# Altium project AMC_FMC_Carrier v2.PrjPcb (part 5 of 9)

## Sheet FPGA_MGT.SchDoc
size A2; DocumentNumber: 17; SheetNumber: 17; SheetTotal: 30
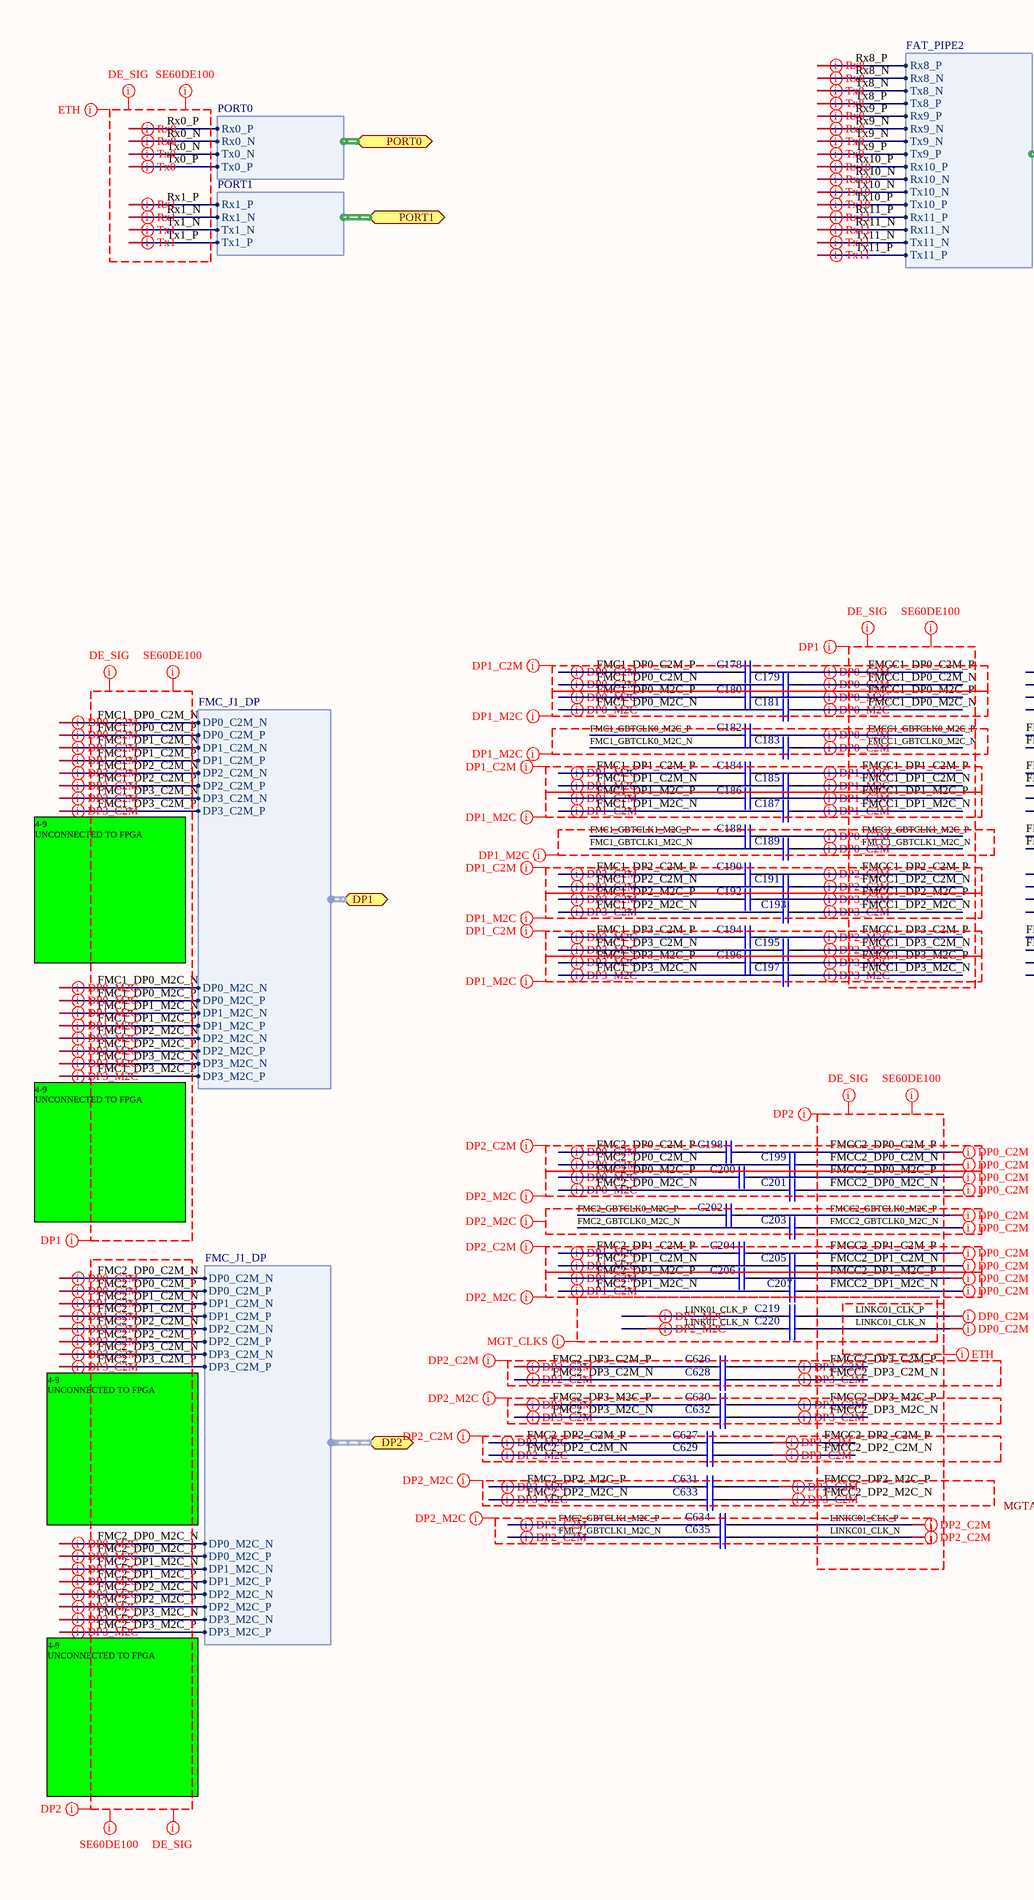
[diagram p7: FPGA_MGT.SchDoc, left]
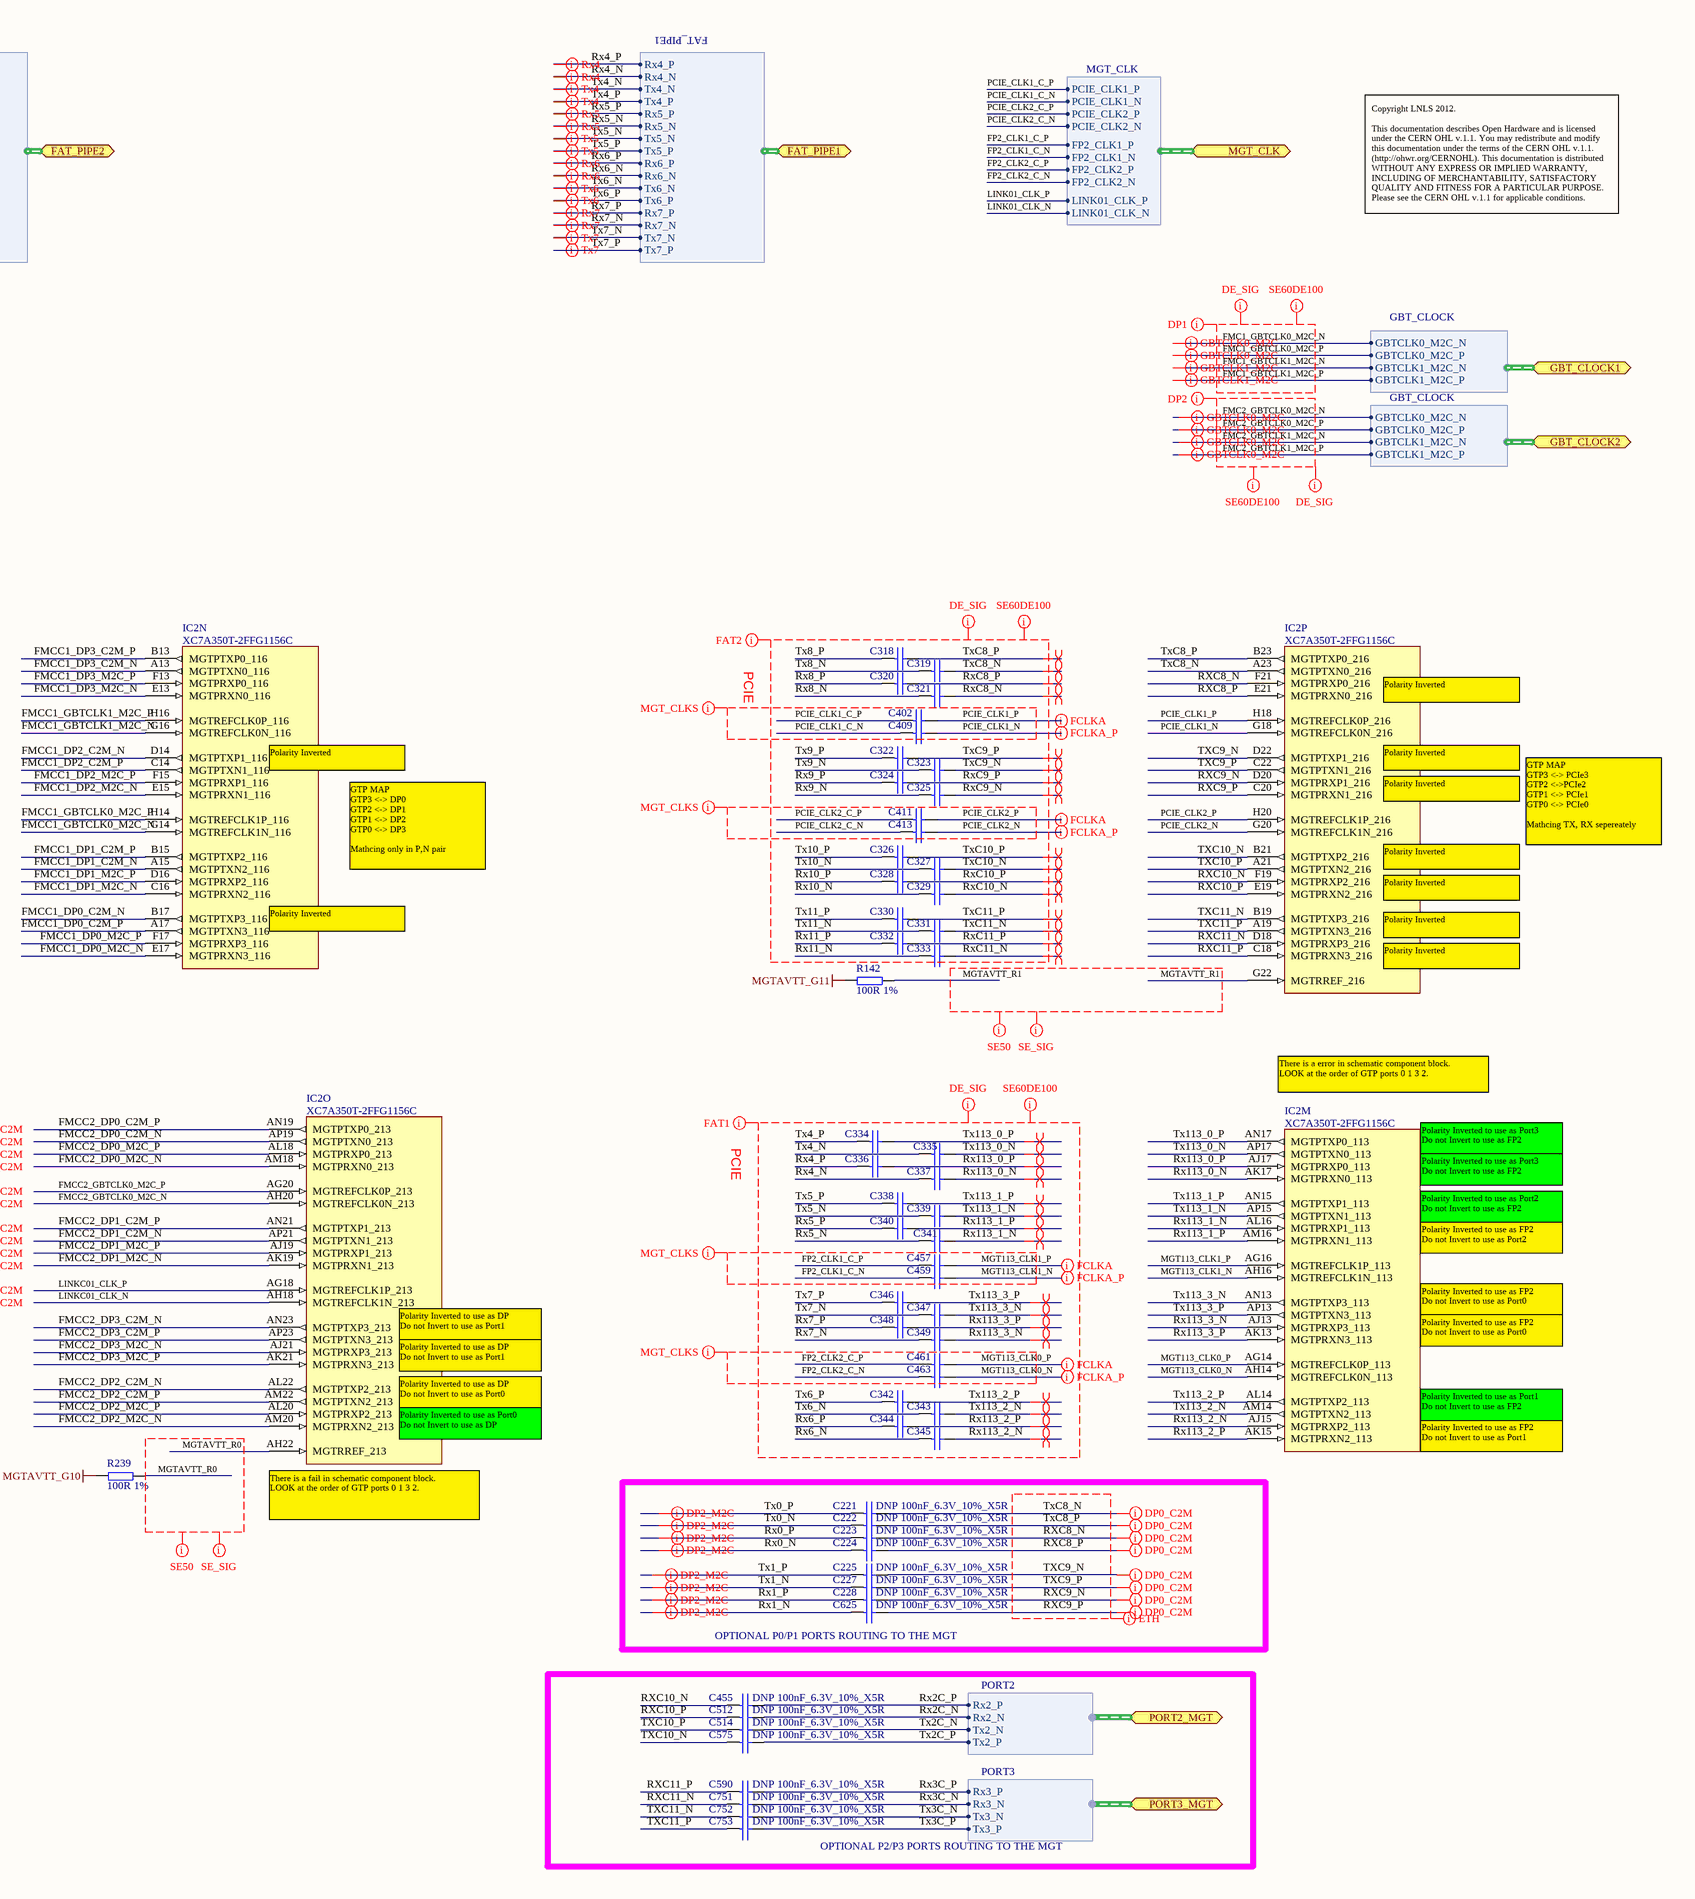
[diagram p8: FPGA_MGT.SchDoc, right]

### Parts
C178  100nF_6.3V_10%_X5R  [0201C]  (value not drawn)
C179  100nF_6.3V_10%_X5R  [0201C]  (value not drawn)
C180  100nF_6.3V_10%_X5R  [0201C]  (value not drawn)
C181  100nF_6.3V_10%_X5R  [0201C]  (value not drawn)
C182  100nF_6.3V_10%_X5R  [0201C]  (value not drawn)
C183  100nF_6.3V_10%_X5R  [0201C]  (value not drawn)
C184  100nF_6.3V_10%_X5R  [0201C]  (value not drawn)
C185  100nF_6.3V_10%_X5R  [0201C]  (value not drawn)
C186  100nF_6.3V_10%_X5R  [0201C]  (value not drawn)
C187  100nF_6.3V_10%_X5R  [0201C]  (value not drawn)
C188  100nF_6.3V_10%_X5R  [0201C]  (value not drawn)
C189  100nF_6.3V_10%_X5R  [0201C]  (value not drawn)
C190  100nF_6.3V_10%_X5R  [0201C]  (value not drawn)
C191  100nF_6.3V_10%_X5R  [0201C]  (value not drawn)
C192  100nF_6.3V_10%_X5R  [0201C]  (value not drawn)
C193  100nF_6.3V_10%_X5R  [0201C]  (value not drawn)
C194  100nF_6.3V_10%_X5R  [0201C]  (value not drawn)
C195  100nF_6.3V_10%_X5R  [0201C]  (value not drawn)
C196  100nF_6.3V_10%_X5R  [0201C]  (value not drawn)
C197  100nF_6.3V_10%_X5R  [0201C]  (value not drawn)
C198  100nF_6.3V_10%_X5R  [0201C]  (value not drawn)
C199  100nF_6.3V_10%_X5R  [0201C]  (value not drawn)
C200  100nF_6.3V_10%_X5R  [0201C]  (value not drawn)
C201  100nF_6.3V_10%_X5R  [0201C]  (value not drawn)
C202  100nF_6.3V_10%_X5R  [0201C]  (value not drawn)
C203  100nF_6.3V_10%_X5R  [0201C]  (value not drawn)
C204  100nF_6.3V_10%_X5R  [0201C]  (value not drawn)
C205  100nF_6.3V_10%_X5R  [0201C]  (value not drawn)
C206  100nF_6.3V_10%_X5R  [0201C]  (value not drawn)
C207  100nF_6.3V_10%_X5R  [0201C]  (value not drawn)
C219  100nF_6.3V_10%_X5R  [0201C]  (value not drawn)
C220  100nF_6.3V_10%_X5R  [0201C]  (value not drawn)
C221  DNP 100nF_6.3V_10%_X5R  [0201C]
C222  DNP 100nF_6.3V_10%_X5R  [0201C]
C223  DNP 100nF_6.3V_10%_X5R  [0201C]
C224  DNP 100nF_6.3V_10%_X5R  [0201C]
C225  DNP 100nF_6.3V_10%_X5R  [0201C]
C227  DNP 100nF_6.3V_10%_X5R  [0201C]
C228  DNP 100nF_6.3V_10%_X5R  [0201C]
C318  100nF_6.3V_10%_X5R  [0201C]  (value not drawn)
C319  100nF_6.3V_10%_X5R  [0201C]  (value not drawn)
C320  100nF_6.3V_10%_X5R  [0201C]  (value not drawn)
C321  100nF_6.3V_10%_X5R  [0201C]  (value not drawn)
C322  100nF_6.3V_10%_X5R  [0201C]  (value not drawn)
C323  100nF_6.3V_10%_X5R  [0201C]  (value not drawn)
C324  100nF_6.3V_10%_X5R  [0201C]  (value not drawn)
C325  100nF_6.3V_10%_X5R  [0201C]  (value not drawn)
C326  100nF_6.3V_10%_X5R  [0201C]  (value not drawn)
C327  100nF_6.3V_10%_X5R  [0201C]  (value not drawn)
C328  100nF_6.3V_10%_X5R  [0201C]  (value not drawn)
C329  100nF_6.3V_10%_X5R  [0201C]  (value not drawn)
C330  100nF_6.3V_10%_X5R  [0201C]  (value not drawn)
C331  100nF_6.3V_10%_X5R  [0201C]  (value not drawn)
C332  100nF_6.3V_10%_X5R  [0201C]  (value not drawn)
C333  100nF_6.3V_10%_X5R  [0201C]  (value not drawn)
C334  100nF_6.3V_10%_X5R  [0201C]  (value not drawn)
C335  100nF_6.3V_10%_X5R  [0201C]  (value not drawn)
C336  100nF_6.3V_10%_X5R  [0201C]  (value not drawn)
C337  100nF_6.3V_10%_X5R  [0201C]  (value not drawn)
C338  100nF_6.3V_10%_X5R  [0201C]  (value not drawn)
C339  100nF_6.3V_10%_X5R  [0201C]  (value not drawn)
C340  100nF_6.3V_10%_X5R  [0201C]  (value not drawn)
C341  100nF_6.3V_10%_X5R  [0201C]  (value not drawn)
C342  100nF_6.3V_10%_X5R  [0201C]  (value not drawn)
C343  100nF_6.3V_10%_X5R  [0201C]  (value not drawn)
C344  100nF_6.3V_10%_X5R  [0201C]  (value not drawn)
C345  100nF_6.3V_10%_X5R  [0201C]  (value not drawn)
C346  100nF_6.3V_10%_X5R  [0201C]  (value not drawn)
C347  100nF_6.3V_10%_X5R  [0201C]  (value not drawn)
C348  100nF_6.3V_10%_X5R  [0201C]  (value not drawn)
C349  100nF_6.3V_10%_X5R  [0201C]  (value not drawn)
C402  100nF_6.3V_10%_X5R  [0201C]  (value not drawn)
C409  100nF_6.3V_10%_X5R  [0201C]  (value not drawn)
C411  100nF_6.3V_10%_X5R  [0201C]  (value not drawn)
C413  100nF_6.3V_10%_X5R  [0201C]  (value not drawn)
C455  DNP 100nF_6.3V_10%_X5R  [0201C]
C457  100nF_6.3V_10%_X5R  [0201C]  (value not drawn)
C459  100nF_6.3V_10%_X5R  [0201C]  (value not drawn)
C461  100nF_6.3V_10%_X5R  [0201C]  (value not drawn)
C463  100nF_6.3V_10%_X5R  [0201C]  (value not drawn)
C512  DNP 100nF_6.3V_10%_X5R  [0201C]
C514  DNP 100nF_6.3V_10%_X5R  [0201C]
C575  DNP 100nF_6.3V_10%_X5R  [0201C]
C590  DNP 100nF_6.3V_10%_X5R  [0201C]
C625  DNP 100nF_6.3V_10%_X5R  [0201C]
C626  100nF_6.3V_10%_X5R  [0201C]  (value not drawn)
C627  100nF_6.3V_10%_X5R  [0201C]  (value not drawn)
C628  100nF_6.3V_10%_X5R  [0201C]  (value not drawn)
C629  100nF_6.3V_10%_X5R  [0201C]  (value not drawn)
C630  100nF_6.3V_10%_X5R  [0201C]  (value not drawn)
C631  100nF_6.3V_10%_X5R  [0201C]  (value not drawn)
C632  100nF_6.3V_10%_X5R  [0201C]  (value not drawn)
C633  100nF_6.3V_10%_X5R  [0201C]  (value not drawn)
C634  100nF_6.3V_10%_X5R  [0201C]  (value not drawn)
C635  100nF_6.3V_10%_X5R  [0201C]  (value not drawn)
C751  DNP 100nF_6.3V_10%_X5R  [0201C]
C752  DNP 100nF_6.3V_10%_X5R  [0201C]
C753  DNP 100nF_6.3V_10%_X5R  [0201C]
IC2  XC7A350T-2FFG1156C  [BGA1156C100P34X34_3500X3500X335]  (parts M,N,O,P of 23)
R142  100R 1%  [0402R]
R239  100R 1%  [0402R]

### Blocks framed on the sheet
OPTIONAL P0/P1 PORTS ROUTING TO THE MGT: C221-C225 C227 C228 C625
OPTIONAL P2/P3 PORTS ROUTING TO THE MGT: C455 C512 C514 C575 C590 C751-C753

### Ports
DP1 (harness FMC_J1_DP), DP2 (harness FMC_J1_DP), FAT_PIPE1 (harness FAT_PIPE1), FAT_PIPE2 (harness FAT_PIPE2), GBT_CLOCK1 (harness GBT_CLOCK), GBT_CLOCK2 (harness GBT_CLOCK), MGT_CLK (harness MGT_CLK), PORT0 (harness PORT0), PORT1 (harness PORT1), PORT2_MGT (harness PORT2), PORT3_MGT (harness PORT3)

### Harnesses
PORT0: Rx0_P, Rx0_N, Tx0_N, Tx0_P
PORT1: Rx1_P, Rx1_N, Tx1_N, Tx1_P
FAT_PIPE1: Rx4_P, Rx4_N, Tx4_N, Tx4_P, Rx5_P, Rx5_N, Tx5_N, Tx5_P, Rx6_P, Rx6_N, Tx6_N, Tx6_P, Rx7_P, Rx7_N, Tx7_N, Tx7_P
FAT_PIPE2: Rx8_P, Rx8_N, Tx8_N, Tx8_P, Rx9_P, Rx9_N, Tx9_N, Tx9_P, Rx10_P, Rx10_N, Tx10_N, Tx10_P, Rx11_P, Rx11_N, Tx11_N, Tx11_P
GBT_CLOCK: GBTCLK0_M2C_N, GBTCLK0_M2C_P, GBTCLK1_M2C_N, GBTCLK1_M2C_P
MGT_CLK: PCIE_CLK1_P, PCIE_CLK1_N, PCIE_CLK2_P, PCIE_CLK2_N, FP2_CLK1_P, FP2_CLK1_N, FP2_CLK2_P, FP2_CLK2_N, LINK01_CLK_P, LINK01_CLK_N
FMC_J1_DP: DP1_C2M_N, DP1_C2M_P, DP1_M2C_N, DP1_M2C_P, DP2_C2M_N, DP2_C2M_P, DP2_M2C_N, DP2_M2C_P, DP3_C2M_N, DP3_C2M_P, DP3_M2C_N, DP3_M2C_P, DP0_C2M_N, DP0_C2M_P, DP0_M2C_N, DP0_M2C_P
PORT3: Rx3_P, Rx3_N, Tx3_N, Tx3_P
PORT2: Rx2_P, Rx2_N, Tx2_N, Tx2_P

### Nets
MGTAVTT_G10: R239.1
MGTAVTT_G11: R142.1
FMC1_DP0_C2M_N: C179.1 ; port DP1.DP0_C2M_N  [project net DP1.DP0_C2M_N]
FMC1_DP0_C2M_P: C178.1 ; port DP1.DP0_C2M_P  [project net DP1.DP0_C2M_P]
FMC1_DP0_M2C_N: C181.1 ; port DP1.DP0_M2C_N  [project net DP1.DP0_M2C_N]
FMC1_DP0_M2C_P: C180.1 ; port DP1.DP0_M2C_P  [project net DP1.DP0_M2C_P]
FMC1_DP1_C2M_N: C185.1 ; port DP1.DP1_C2M_N  [project net DP1.DP1_C2M_N]
FMC1_DP1_C2M_P: C184.1 ; port DP1.DP1_C2M_P  [project net DP1.DP1_C2M_P]
FMC1_DP1_M2C_N: C187.1 ; port DP1.DP1_M2C_N  [project net DP1.DP1_M2C_N]
FMC1_DP1_M2C_P: C186.1 ; port DP1.DP1_M2C_P  [project net DP1.DP1_M2C_P]
FMC1_DP2_C2M_N: C191.1 ; port DP1.DP2_C2M_N  [project net DP1.DP2_C2M_N]
FMC1_DP2_C2M_P: C190.1 ; port DP1.DP2_C2M_P  [project net DP1.DP2_C2M_P]
FMC1_DP2_M2C_N: C193.1 ; port DP1.DP2_M2C_N  [project net DP1.DP2_M2C_N]
FMC1_DP2_M2C_P: C192.1 ; port DP1.DP2_M2C_P  [project net DP1.DP2_M2C_P]
FMC1_DP3_C2M_N: C195.1 ; port DP1.DP3_C2M_N  [project net DP1.DP3_C2M_N]
FMC1_DP3_C2M_P: C194.1 ; port DP1.DP3_C2M_P  [project net DP1.DP3_C2M_P]
FMC1_DP3_M2C_N: C197.1 ; port DP1.DP3_M2C_N  [project net DP1.DP3_M2C_N]
FMC1_DP3_M2C_P: C196.1 ; port DP1.DP3_M2C_P  [project net DP1.DP3_M2C_P]
FMC1_GBTCLK0_M2C_N: C183.1 ; port GBT_CLOCK1.GBTCLK0_M2C_N  [project net GBT1.GBTCLK0_M2C_N]
FMC1_GBTCLK0_M2C_P: C182.1 ; port GBT_CLOCK1.GBTCLK0_M2C_P  [project net GBT1.GBTCLK0_M2C_P]
FMC1_GBTCLK1_M2C_N: C189.1 ; port GBT_CLOCK1.GBTCLK1_M2C_N  [project net GBT1.GBTCLK1_M2C_N]
FMC1_GBTCLK1_M2C_P: C188.1 ; port GBT_CLOCK1.GBTCLK1_M2C_P  [project net GBT1.GBTCLK1_M2C_P]
FMC2_DP0_C2M_N: C199.1 ; port DP2.DP0_C2M_N  [project net DP2.DP0_C2M_N]
FMC2_DP0_C2M_P: C198.1 ; port DP2.DP0_C2M_P  [project net DP2.DP0_C2M_P]
FMC2_DP0_M2C_N: C201.1 ; port DP2.DP0_M2C_N  [project net DP2.DP0_M2C_N]
FMC2_DP0_M2C_P: C200.1 ; port DP2.DP0_M2C_P  [project net DP2.DP0_M2C_P]
FMC2_DP1_C2M_N: C205.1 ; port DP2.DP1_C2M_N  [project net DP2.DP1_C2M_N]
FMC2_DP1_C2M_P: C204.1 ; port DP2.DP1_C2M_P  [project net DP2.DP1_C2M_P]
FMC2_DP1_M2C_N: C207.1 ; port DP2.DP1_M2C_N  [project net DP2.DP1_M2C_N]
FMC2_DP1_M2C_P: C206.1 ; port DP2.DP1_M2C_P  [project net DP2.DP1_M2C_P]
FMC2_DP2_C2M_N: C629.1 ; port DP2.DP2_C2M_N  [project net DP2.DP2_C2M_N]
FMC2_DP2_C2M_P: C627.1 ; port DP2.DP2_C2M_P  [project net DP2.DP2_C2M_P]
FMC2_DP2_M2C_N: C633.1 ; port DP2.DP2_M2C_N  [project net DP2.DP2_M2C_N]
FMC2_DP2_M2C_P: C631.1 ; port DP2.DP2_M2C_P  [project net DP2.DP2_M2C_P]
FMC2_DP3_C2M_N: C628.1 ; port DP2.DP3_C2M_N  [project net DP2.DP3_C2M_N]
FMC2_DP3_C2M_P: C626.1 ; port DP2.DP3_C2M_P  [project net DP2.DP3_C2M_P]
FMC2_DP3_M2C_N: C632.1 ; port DP2.DP3_M2C_N  [project net DP2.DP3_M2C_N]
FMC2_DP3_M2C_P: C630.1 ; port DP2.DP3_M2C_P  [project net DP2.DP3_M2C_P]
FMC2_GBTCLK0_M2C_N: C203.1 ; port GBT_CLOCK2.GBTCLK0_M2C_N  [project net GBT2.GBTCLK0_M2C_N]
FMC2_GBTCLK0_M2C_P: C202.1 ; port GBT_CLOCK2.GBTCLK0_M2C_P  [project net GBT2.GBTCLK0_M2C_P]
FMC2_GBTCLK1_M2C_N: C635.1 ; port GBT_CLOCK2.GBTCLK1_M2C_N  [project net GBT2.GBTCLK1_M2C_N]
FMC2_GBTCLK1_M2C_P: C634.1 ; port GBT_CLOCK2.GBTCLK1_M2C_P  [project net GBT2.GBTCLK1_M2C_P]
FMCC1_DP0_C2M_N: C179.2 IC2.B17(MGTPTXP3_116)
FMCC1_DP0_C2M_P: C178.2 IC2.A17(MGTPTXN3_116)
FMCC1_DP0_M2C_N: C181.2 IC2.E17(MGTPRXN3_116)
FMCC1_DP0_M2C_P: C180.2 IC2.F17(MGTPRXP3_116)
FMCC1_DP1_C2M_N: C185.2 IC2.A15(MGTPTXN2_116)
FMCC1_DP1_C2M_P: C184.2 IC2.B15(MGTPTXP2_116)
FMCC1_DP1_M2C_N: C187.2 IC2.C16(MGTPRXN2_116)
FMCC1_DP1_M2C_P: C186.2 IC2.D16(MGTPRXP2_116)
FMCC1_DP2_C2M_N: C191.2 IC2.D14(MGTPTXP1_116)
FMCC1_DP2_C2M_P: C190.2 IC2.C14(MGTPTXN1_116)
FMCC1_DP2_M2C_N: C193.2 IC2.E15(MGTPRXN1_116)
FMCC1_DP2_M2C_P: C192.2 IC2.F15(MGTPRXP1_116)
FMCC1_DP3_C2M_N: C195.2 IC2.A13(MGTPTXN0_116)
FMCC1_DP3_C2M_P: C194.2 IC2.B13(MGTPTXP0_116)
FMCC1_DP3_M2C_N: C197.2 IC2.E13(MGTPRXN0_116)
FMCC1_DP3_M2C_P: C196.2 IC2.F13(MGTPRXP0_116)
FMCC1_GBTCLK0_M2C_N: C183.2 IC2.G14(MGTREFCLK1N_116)
FMCC1_GBTCLK0_M2C_P: C182.2 IC2.H14(MGTREFCLK1P_116)
FMCC1_GBTCLK1_M2C_N: C189.2 IC2.G16(MGTREFCLK0N_116)
FMCC1_GBTCLK1_M2C_P: C188.2 IC2.H16(MGTREFCLK0P_116)
FMCC2_DP0_C2M_N: C199.2 IC2.AP19(MGTPTXN0_213)
FMCC2_DP0_C2M_P: C198.2 IC2.AN19(MGTPTXP0_213)
FMCC2_DP0_M2C_N: C201.2 IC2.AM18(MGTPRXN0_213)
FMCC2_DP0_M2C_P: C200.2 IC2.AL18(MGTPRXP0_213)
FMCC2_DP1_C2M_N: C205.2 IC2.AP21(MGTPTXN1_213)
FMCC2_DP1_C2M_P: C204.2 IC2.AN21(MGTPTXP1_213)
FMCC2_DP1_M2C_N: C207.2 IC2.AK19(MGTPRXN1_213)
FMCC2_DP1_M2C_P: C206.2 IC2.AJ19(MGTPRXP1_213)
FMCC2_DP2_C2M_N: C629.2 IC2.AL22(MGTPTXP2_213)
FMCC2_DP2_C2M_P: C627.2 IC2.AM22(MGTPTXN2_213)
FMCC2_DP2_M2C_N: C633.2 IC2.AM20(MGTPRXN2_213)
FMCC2_DP2_M2C_P: C631.2 IC2.AL20(MGTPRXP2_213)
FMCC2_DP3_C2M_N: C628.2 IC2.AN23(MGTPTXP3_213)
FMCC2_DP3_C2M_P: C626.2 IC2.AP23(MGTPTXN3_213)
FMCC2_DP3_M2C_N: C632.2 IC2.AJ21(MGTPRXP3_213)
FMCC2_DP3_M2C_P: C630.2 IC2.AK21(MGTPRXN3_213)
FMCC2_GBTCLK0_M2C_N: C203.2 IC2.AH20(MGTREFCLK0N_213)
FMCC2_GBTCLK0_M2C_P: C202.2 IC2.AG20(MGTREFCLK0P_213)
FP2_CLK1_C_N: C459.1 ; port MGT_CLK.FP2_CLK1_N  [project net MGT.FP2_CLK1_N]
FP2_CLK1_C_P: C457.1 ; port MGT_CLK.FP2_CLK1_P  [project net MGT.FP2_CLK1_P]
FP2_CLK2_C_N: C463.1 ; port MGT_CLK.FP2_CLK2_N  [project net MGT.FP2_CLK2_N]
FP2_CLK2_C_P: C461.1 ; port MGT_CLK.FP2_CLK2_P  [project net MGT.FP2_CLK2_P]
LINK01_CLK_N: C220.1 ; port MGT_CLK.LINK01_CLK_N  [project net MGT.LINK01_CLK_N]
LINK01_CLK_P: C219.1 ; port MGT_CLK.LINK01_CLK_P  [project net MGT.LINK01_CLK_P]
LINKC01_CLK_N: C220.2 C635.2 IC2.AH18(MGTREFCLK1N_213)
LINKC01_CLK_P: C219.2 C634.2 IC2.AG18(MGTREFCLK1P_213)
MGT113_CLK0_N: C463.2 IC2.AH14(MGTREFCLK0N_113)
MGT113_CLK0_P: C461.2 IC2.AG14(MGTREFCLK0P_113)
MGT113_CLK1_N: C459.2 IC2.AH16(MGTREFCLK1N_113)
MGT113_CLK1_P: C457.2 IC2.AG16(MGTREFCLK1P_113)
MGTAVTT_R0: IC2.AH22(MGTRREF_213) R239.2
MGTAVTT_R1: IC2.G22(MGTRREF_216) R142.2
PCIE_CLK1_C_N: C409.1 ; port MGT_CLK.PCIE_CLK1_N  [project net MGT.PCIE_CLK1_N]
PCIE_CLK1_C_P: C402.1 ; port MGT_CLK.PCIE_CLK1_P  [project net MGT.PCIE_CLK1_P]
PCIE_CLK1_N: C409.2 IC2.G18(MGTREFCLK0N_216)
PCIE_CLK1_P: C402.2 IC2.H18(MGTREFCLK0P_216)
PCIE_CLK2_C_N: C413.1 ; port MGT_CLK.PCIE_CLK2_N  [project net MGT.PCIE_CLK2_N]
PCIE_CLK2_C_P: C411.1 ; port MGT_CLK.PCIE_CLK2_P  [project net MGT.PCIE_CLK2_P]
PCIE_CLK2_N: C413.2 IC2.G20(MGTREFCLK1N_216)
PCIE_CLK2_P: C411.2 IC2.H20(MGTREFCLK1P_216)
Rx0_N: C224.1 ; port PORT0.Rx0_N  [project net PORT0.Rx0_N]
Rx0_P: C223.1 ; port PORT0.Rx0_P  [project net PORT0.Rx0_P]
Rx1_N: C625.1 ; port PORT1.Rx1_N  [project net PORT1.Rx1_N]
Rx1_P: C228.1 ; port PORT1.Rx1_P  [project net PORT1.Rx1_P]
Rx2C_N: C512.2 ; port PORT2_MGT.Rx2_N
Rx2C_P: C455.2 ; port PORT2_MGT.Rx2_P
Rx3C_N: C751.2 ; port PORT3_MGT.Rx3_N
Rx3C_P: C590.2 ; port PORT3_MGT.Rx3_P
Rx4_N: C337.1 ; port FAT_PIPE1.Rx4_N  [project net PIPE1.Rx4_N]
Rx4_P: C336.1 ; port FAT_PIPE1.Rx4_P  [project net PIPE1.Rx4_P]
Rx5_N: C341.1 ; port FAT_PIPE1.Rx5_N  [project net PIPE1.Rx5_N]
Rx5_P: C340.1 ; port FAT_PIPE1.Rx5_P  [project net PIPE1.Rx5_P]
Rx6_N: C345.1 ; port FAT_PIPE1.Rx6_N  [project net PIPE1.Rx6_N]
Rx6_P: C344.1 ; port FAT_PIPE1.Rx6_P  [project net PIPE1.Rx6_P]
Rx7_N: C349.1 ; port FAT_PIPE1.Rx7_N  [project net PIPE1.Rx7_N]
Rx7_P: C348.1 ; port FAT_PIPE1.Rx7_P  [project net PIPE1.Rx7_P]
Rx8_N: C321.1 ; port FAT_PIPE2.Rx8_N  [project net PIPE2.Rx8_N]
Rx8_P: C320.1 ; port FAT_PIPE2.Rx8_P  [project net PIPE2.Rx8_P]
Rx9_N: C325.1 ; port FAT_PIPE2.Rx9_N  [project net PIPE2.Rx9_N]
Rx9_P: C324.1 ; port FAT_PIPE2.Rx9_P  [project net PIPE2.Rx9_P]
Rx10_N: C329.1 ; port FAT_PIPE2.Rx10_N  [project net PIPE2.Rx10_N]
Rx10_P: C328.1 ; port FAT_PIPE2.Rx10_P  [project net PIPE2.Rx10_P]
Rx11_N: C333.1 ; port FAT_PIPE2.Rx11_N  [project net PIPE2.Rx11_N]
Rx11_P: C332.1 ; port FAT_PIPE2.Rx11_P  [project net PIPE2.Rx11_P]
Rx113_0_N: C337.2 IC2.AK17(MGTPRXN0_113)
Rx113_0_P: C336.2 IC2.AJ17(MGTPRXP0_113)
Rx113_1_N: C341.2 IC2.AL16(MGTPRXP1_113)
Rx113_1_P: C340.2 IC2.AM16(MGTPRXN1_113)
Rx113_2_N: C345.2 IC2.AJ15(MGTPRXP2_113)
Rx113_2_P: C344.2 IC2.AK15(MGTPRXN2_113)
Rx113_3_N: C349.2 IC2.AJ13(MGTPRXP3_113)
Rx113_3_P: C348.2 IC2.AK13(MGTPRXN3_113)
RxC8_N: C223.2 C321.2 IC2.F21(MGTPRXP0_216)
RxC8_P: C224.2 C320.2 IC2.E21(MGTPRXN0_216)
RxC9_N: C228.2 C325.2 IC2.D20(MGTPRXP1_216)
RxC9_P: C324.2 C625.2 IC2.C20(MGTPRXN1_216)
RxC10_N: C329.2 C455.1 IC2.F19(MGTPRXP2_216)
RxC10_P: C328.2 C512.1 IC2.E19(MGTPRXN2_216)
RxC11_N: C333.2 C751.1 IC2.D18(MGTPRXP3_216)
RxC11_P: C332.2 C590.1 IC2.C18(MGTPRXN3_216)
Tx0_N: C222.1 ; port PORT0.Tx0_N  [project net PORT0.Tx0_N]
Tx0_P: C221.1 ; port PORT0.Tx0_P  [project net PORT0.Tx0_P]
Tx1_N: C227.1 ; port PORT1.Tx1_N  [project net PORT1.Tx1_N]
Tx1_P: C225.1 ; port PORT1.Tx1_P  [project net PORT1.Tx1_P]
Tx2C_N: C514.2 ; port PORT2_MGT.Tx2_N
Tx2C_P: C575.2 ; port PORT2_MGT.Tx2_P
Tx3C_N: C752.2 ; port PORT3_MGT.Tx3_N
Tx3C_P: C753.2 ; port PORT3_MGT.Tx3_P
Tx4_N: C335.1 ; port FAT_PIPE1.Tx4_N  [project net PIPE1.Tx4_N]
Tx4_P: C334.1 ; port FAT_PIPE1.Tx4_P  [project net PIPE1.Tx4_P]
Tx5_N: C339.1 ; port FAT_PIPE1.Tx5_N  [project net PIPE1.Tx5_N]
Tx5_P: C338.1 ; port FAT_PIPE1.Tx5_P  [project net PIPE1.Tx5_P]
Tx6_N: C343.1 ; port FAT_PIPE1.Tx6_N  [project net PIPE1.Tx6_N]
Tx6_P: C342.1 ; port FAT_PIPE1.Tx6_P  [project net PIPE1.Tx6_P]
Tx7_N: C347.1 ; port FAT_PIPE1.Tx7_N  [project net PIPE1.Tx7_N]
Tx7_P: C346.1 ; port FAT_PIPE1.Tx7_P  [project net PIPE1.Tx7_P]
Tx8_N: C319.1 ; port FAT_PIPE2.Tx8_N  [project net PIPE2.Tx8_N]
Tx8_P: C318.1 ; port FAT_PIPE2.Tx8_P  [project net PIPE2.Tx8_P]
Tx9_N: C323.1 ; port FAT_PIPE2.Tx9_N  [project net PIPE2.Tx9_N]
Tx9_P: C322.1 ; port FAT_PIPE2.Tx9_P  [project net PIPE2.Tx9_P]
Tx10_N: C327.1 ; port FAT_PIPE2.Tx10_N  [project net PIPE2.Tx10_N]
Tx10_P: C326.1 ; port FAT_PIPE2.Tx10_P  [project net PIPE2.Tx10_P]
Tx11_N: C331.1 ; port FAT_PIPE2.Tx11_N  [project net PIPE2.Tx11_N]
Tx11_P: C330.1 ; port FAT_PIPE2.Tx11_P  [project net PIPE2.Tx11_P]
Tx113_0_N: C335.2 IC2.AP17(MGTPTXN0_113)
Tx113_0_P: C334.2 IC2.AN17(MGTPTXP0_113)
Tx113_1_N: C339.2 IC2.AP15(MGTPTXN1_113)
Tx113_1_P: C338.2 IC2.AN15(MGTPTXP1_113)
Tx113_2_N: C343.2 IC2.AM14(MGTPTXN2_113)
Tx113_2_P: C342.2 IC2.AL14(MGTPTXP2_113)
Tx113_3_N: C347.2 IC2.AN13(MGTPTXP3_113)
Tx113_3_P: C346.2 IC2.AP13(MGTPTXN3_113)
TxC8_N: C221.2 C319.2 IC2.A23(MGTPTXN0_216)
TxC8_P: C222.2 C318.2 IC2.B23(MGTPTXP0_216)
TxC9_N: C225.2 C323.2 IC2.D22(MGTPTXP1_216)
TxC9_P: C227.2 C322.2 IC2.C22(MGTPTXN1_216)
TxC10_N: C327.2 C575.1 IC2.B21(MGTPTXP2_216)
TxC10_P: C326.2 C514.1 IC2.A21(MGTPTXN2_216)
TxC11_N: C331.2 C752.1 IC2.B19(MGTPTXP3_216)
TxC11_P: C330.2 C753.1 IC2.A19(MGTPTXN3_216)

### Layout directives
differential pair: DP1.DP0_C2M_N, DP1.DP0_C2M_P, DP1.DP0_M2C_N, DP1.DP0_M2C_P, DP1.DP1_C2M_N, DP1.DP1_C2M_P, DP1.DP1_M2C_N, DP1.DP1_M2C_P, DP1.DP2_C2M_N, DP1.DP2_C2M_P, DP1.DP2_M2C_N, DP1.DP2_M2C_P, DP1.DP3_C2M_N, DP1.DP3_C2M_P, DP1.DP3_M2C_N, DP1.DP3_M2C_P, DP2.DP0_C2M_N, DP2.DP0_C2M_P, DP2.DP0_M2C_N, DP2.DP0_M2C_P, DP2.DP1_C2M_N, DP2.DP1_C2M_P, DP2.DP1_M2C_N, DP2.DP1_M2C_P, DP2.DP2_C2M_N, DP2.DP2_C2M_P, DP2.DP2_M2C_N, DP2.DP2_M2C_P, DP2.DP3_C2M_N, DP2.DP3_C2M_P, DP2.DP3_M2C_N, DP2.DP3_M2C_P, FMCC1_DP0_C2M_N, FMCC1_DP0_C2M_P, FMCC1_DP0_M2C_N, FMCC1_DP0_M2C_P, FMCC1_DP1_C2M_N, FMCC1_DP1_C2M_P, FMCC1_DP1_M2C_N, FMCC1_DP1_M2C_P, FMCC1_DP2_C2M_N, FMCC1_DP2_C2M_P, FMCC1_DP2_M2C_N, FMCC1_DP2_M2C_P, FMCC1_DP3_C2M_N, FMCC1_DP3_C2M_P, FMCC1_DP3_M2C_N, FMCC1_DP3_M2C_P, FMCC1_GBTCLK0_M2C_N, FMCC1_GBTCLK0_M2C_P, FMCC1_GBTCLK1_M2C_N, FMCC1_GBTCLK1_M2C_P, FMCC2_DP0_C2M_N, FMCC2_DP0_C2M_P, FMCC2_DP0_M2C_N, FMCC2_DP0_M2C_P, FMCC2_DP1_C2M_N, FMCC2_DP1_C2M_P, FMCC2_DP1_M2C_N, FMCC2_DP1_M2C_P, FMCC2_DP2_C2M_N, FMCC2_DP2_C2M_P, FMCC2_DP2_M2C_N, FMCC2_DP2_M2C_P, FMCC2_DP3_C2M_N, FMCC2_DP3_C2M_P, FMCC2_DP3_M2C_N, FMCC2_DP3_M2C_P, FMCC2_GBTCLK0_M2C_N, FMCC2_GBTCLK0_M2C_P, GBT1.GBTCLK0_M2C_N, GBT1.GBTCLK0_M2C_P, GBT1.GBTCLK1_M2C_N, GBT1.GBTCLK1_M2C_P, GBT2.GBTCLK0_M2C_N, GBT2.GBTCLK0_M2C_P, GBT2.GBTCLK1_M2C_N, GBT2.GBTCLK1_M2C_P, LINKC01_CLK_N, LINKC01_CLK_P, MGT113_CLK0_N, MGT113_CLK0_P, MGT113_CLK1_N, MGT113_CLK1_P, MGT.LINK01_CLK_N, MGT.LINK01_CLK_P, PCIE_CLK1_N, PCIE_CLK1_P, PCIE_CLK2_N, PCIE_CLK2_P, PIPE1.Rx4_N, PIPE1.Rx4_P, PIPE1.Rx5_N, PIPE1.Rx5_P, PIPE1.Rx6_N, PIPE1.Rx6_P, PIPE1.Rx7_N, PIPE1.Rx7_P, PIPE1.Tx4_N, PIPE1.Tx4_P, PIPE1.Tx5_N, PIPE1.Tx5_P, PIPE1.Tx6_N, PIPE1.Tx6_P, PIPE1.Tx7_N, PIPE1.Tx7_P, PIPE2.Rx8_N, PIPE2.Rx8_P, PIPE2.Rx9_N, PIPE2.Rx9_P, PIPE2.Rx10_N, PIPE2.Rx10_P, PIPE2.Rx11_N, PIPE2.Rx11_P, PIPE2.Tx8_N, PIPE2.Tx8_P, PIPE2.Tx9_N, PIPE2.Tx9_P, PIPE2.Tx10_N, PIPE2.Tx10_P, PIPE2.Tx11_N, PIPE2.Tx11_P, PORT0.Rx0_N, PORT0.Rx0_P, PORT0.Tx0_N, PORT0.Tx0_P, PORT1.Rx1_N, PORT1.Rx1_P, PORT1.Tx1_N, PORT1.Tx1_P, Rx113_0_N, Rx113_0_P, Rx113_1_N, Rx113_1_P, Rx113_2_N, Rx113_2_P, Rx113_3_N, Rx113_3_P, RxC8_N, RxC8_P, RxC9_N, RxC9_P, RxC10_N, RxC10_P, RxC11_N, RxC11_P, Tx113_0_N, Tx113_0_P, Tx113_1_N, Tx113_1_P, Tx113_2_N, Tx113_2_P, Tx113_3_N, Tx113_3_P, TxC8_N, TxC8_P, TxC9_N, TxC9_P, TxC10_N, TxC10_P, TxC11_N, TxC11_P
net class FAT2: PCIE_CLK1_C_N, PCIE_CLK1_C_P, PCIE_CLK1_N, PCIE_CLK1_P, PCIE_CLK2_C_N, PCIE_CLK2_C_P, PCIE_CLK2_N, PCIE_CLK2_P, Rx8_N, Rx8_P, Rx9_N, Rx9_P, Rx10_N, Rx10_P, Rx11_N, Rx11_P, RxC8_N, RxC8_P, RxC9_N, RxC9_P, RxC10_N, RxC10_P, RxC11_N, RxC11_P, Tx8_N, Tx8_P, Tx9_N, Tx9_P, Tx10_N, Tx10_P, Tx11_N, Tx11_P, TxC8_N, TxC8_P, TxC9_N, TxC9_P, TxC10_N, TxC10_P, TxC11_N, TxC11_P
net class FAT1: FP2_CLK1_C_N, FP2_CLK1_C_P, FP2_CLK2_C_N, FP2_CLK2_C_P, MGT113_CLK0_N, MGT113_CLK0_P, MGT113_CLK1_N, MGT113_CLK1_P, Rx4_N, Rx4_P, Rx5_N, Rx5_P, Rx6_N, Rx6_P, Rx7_N, Rx7_P, Rx113_0_N, Rx113_0_P, Rx113_1_N, Rx113_1_P, Rx113_2_N, Rx113_2_P, Rx113_3_N, Rx113_3_P, Tx4_N, Tx4_P, Tx5_N, Tx5_P, Tx6_N, Tx6_P, Tx7_N, Tx7_P, Tx113_0_N, Tx113_0_P, Tx113_1_N, Tx113_1_P, Tx113_2_N, Tx113_2_P, Tx113_3_N, Tx113_3_P
net class DP2: FMC2_DP0_C2M_N, FMC2_DP0_C2M_P, FMC2_DP0_M2C_N, FMC2_DP0_M2C_P, FMC2_DP1_C2M_N, FMC2_DP1_C2M_P, FMC2_DP1_M2C_N, FMC2_DP1_M2C_P, FMC2_DP2_C2M_N, FMC2_DP2_C2M_P, FMC2_DP2_M2C_N, FMC2_DP2_M2C_P, FMC2_DP3_C2M_N, FMC2_DP3_C2M_P, FMC2_DP3_M2C_N, FMC2_DP3_M2C_P, FMC2_GBTCLK0_M2C_N, FMC2_GBTCLK0_M2C_P, FMC2_GBTCLK1_M2C_N, FMC2_GBTCLK1_M2C_P, FMCC2_DP0_C2M_N, FMCC2_DP0_C2M_P, FMCC2_DP0_M2C_N, FMCC2_DP0_M2C_P, FMCC2_DP1_C2M_N, FMCC2_DP1_C2M_P, FMCC2_DP1_M2C_N, FMCC2_DP1_M2C_P, FMCC2_DP2_C2M_N, FMCC2_DP2_C2M_P, FMCC2_DP2_M2C_N, FMCC2_DP2_M2C_P, FMCC2_DP3_C2M_N, FMCC2_DP3_C2M_P, FMCC2_DP3_M2C_N, FMCC2_DP3_M2C_P, FMCC2_GBTCLK0_M2C_N, FMCC2_GBTCLK0_M2C_P, LINKC01_CLK_N, LINKC01_CLK_P
net class DP1: FMC1_DP0_C2M_N, FMC1_DP0_C2M_P, FMC1_DP0_M2C_N, FMC1_DP0_M2C_P, FMC1_DP1_C2M_N, FMC1_DP1_C2M_P, FMC1_DP1_M2C_N, FMC1_DP1_M2C_P, FMC1_DP2_C2M_N, FMC1_DP2_C2M_P, FMC1_DP2_M2C_N, FMC1_DP2_M2C_P, FMC1_DP3_C2M_N, FMC1_DP3_C2M_P, FMC1_DP3_M2C_N, FMC1_DP3_M2C_P, FMC1_GBTCLK0_M2C_N, FMC1_GBTCLK0_M2C_P, FMC1_GBTCLK1_M2C_N, FMC1_GBTCLK1_M2C_P, FMCC1_DP0_C2M_N, FMCC1_DP0_C2M_P, FMCC1_DP0_M2C_N, FMCC1_DP0_M2C_P, FMCC1_DP1_C2M_N, FMCC1_DP1_C2M_P, FMCC1_DP1_M2C_N, FMCC1_DP1_M2C_P, FMCC1_DP2_C2M_N, FMCC1_DP2_C2M_P, FMCC1_DP2_M2C_N, FMCC1_DP2_M2C_P, FMCC1_DP3_C2M_N, FMCC1_DP3_C2M_P, FMCC1_DP3_M2C_N, FMCC1_DP3_M2C_P, FMCC1_GBTCLK0_M2C_N, FMCC1_GBTCLK0_M2C_P, FMCC1_GBTCLK1_M2C_N, FMCC1_GBTCLK1_M2C_P
net class ETH: LINKC01_CLK_N, LINKC01_CLK_P, Rx0_N, Rx0_P, Rx1_N, Rx1_P, RXC8_N, RXC8_P, RXC9_N, RXC9_P, Tx0_N, Tx0_P, Tx1_N, Tx1_P, TxC8_N, TxC8_P, TXC9_N, TXC9_P
net class MGT_CLKS: FP2_CLK1_C_N, FP2_CLK1_C_P, FP2_CLK2_C_N, FP2_CLK2_C_P, LINK01_CLK_N, LINK01_CLK_P, LINKC01_CLK_N, LINKC01_CLK_P, MGT113_CLK0_N, MGT113_CLK0_P, MGT113_CLK1_N, MGT113_CLK1_P, PCIE_CLK1_C_N, PCIE_CLK1_C_P, PCIE_CLK1_N, PCIE_CLK1_P, PCIE_CLK2_C_N, PCIE_CLK2_C_P, PCIE_CLK2_N, PCIE_CLK2_P
net class SE60DE100: FMC1_DP0_C2M_N, FMC1_DP0_C2M_P, FMC1_DP0_M2C_N, FMC1_DP0_M2C_P, FMC1_DP1_C2M_N, FMC1_DP1_C2M_P, FMC1_DP1_M2C_N, FMC1_DP1_M2C_P, FMC1_DP2_C2M_N, FMC1_DP2_C2M_P, FMC1_DP2_M2C_N, FMC1_DP2_M2C_P, FMC1_DP3_C2M_N, FMC1_DP3_C2M_P, FMC1_DP3_M2C_N, FMC1_DP3_M2C_P, FMC1_GBTCLK0_M2C_N, FMC1_GBTCLK0_M2C_P, FMC1_GBTCLK1_M2C_N, FMC1_GBTCLK1_M2C_P, FMC2_DP0_C2M_N, FMC2_DP0_C2M_P, FMC2_DP0_M2C_N, FMC2_DP0_M2C_P, FMC2_DP1_C2M_N, FMC2_DP1_C2M_P, FMC2_DP1_M2C_N, FMC2_DP1_M2C_P, FMC2_DP2_C2M_N, FMC2_DP2_C2M_P, FMC2_DP2_M2C_N, FMC2_DP2_M2C_P, FMC2_DP3_C2M_N, FMC2_DP3_C2M_P, FMC2_DP3_M2C_N, FMC2_DP3_M2C_P, FMC2_GBTCLK0_M2C_N, FMC2_GBTCLK0_M2C_P, FMC2_GBTCLK1_M2C_N, FMC2_GBTCLK1_M2C_P, FMCC1_DP0_C2M_N, FMCC1_DP0_C2M_P, FMCC1_DP0_M2C_N, FMCC1_DP0_M2C_P, FMCC1_DP1_C2M_N, FMCC1_DP1_C2M_P, FMCC1_DP1_M2C_N, FMCC1_DP1_M2C_P, FMCC1_DP2_C2M_N, FMCC1_DP2_C2M_P, FMCC1_DP2_M2C_N, FMCC1_DP2_M2C_P, FMCC1_DP3_C2M_N, FMCC1_DP3_C2M_P, FMCC1_DP3_M2C_N, FMCC1_DP3_M2C_P, FMCC1_GBTCLK0_M2C_N, FMCC1_GBTCLK0_M2C_P, FMCC1_GBTCLK1_M2C_N, FMCC1_GBTCLK1_M2C_P, FMCC2_DP0_C2M_N, FMCC2_DP0_C2M_P, FMCC2_DP0_M2C_N, FMCC2_DP0_M2C_P, FMCC2_DP1_C2M_N, FMCC2_DP1_C2M_P, FMCC2_DP1_M2C_N, FMCC2_DP1_M2C_P, FMCC2_DP2_C2M_N, FMCC2_DP2_C2M_P, FMCC2_DP2_M2C_N, FMCC2_DP2_M2C_P, FMCC2_DP3_C2M_N, FMCC2_DP3_C2M_P, FMCC2_DP3_M2C_N, FMCC2_DP3_M2C_P, FMCC2_GBTCLK0_M2C_N, FMCC2_GBTCLK0_M2C_P, FP2_CLK1_C_N, FP2_CLK1_C_P, FP2_CLK2_C_N, FP2_CLK2_C_P, LINKC01_CLK_N, LINKC01_CLK_P, MGT113_CLK0_N, MGT113_CLK0_P, MGT113_CLK1_N, MGT113_CLK1_P, PCIE_CLK1_C_N, PCIE_CLK1_C_P, PCIE_CLK1_N, PCIE_CLK1_P, PCIE_CLK2_C_N, PCIE_CLK2_C_P, PCIE_CLK2_N, PCIE_CLK2_P, Rx0_N, Rx0_P, Rx1_N, Rx1_P, Rx4_N, Rx4_P, Rx5_N, Rx5_P, Rx6_N, Rx6_P, Rx7_N, Rx7_P, Rx8_N, Rx8_P, Rx9_N, Rx9_P, Rx10_N, Rx10_P, Rx11_N, Rx11_P, Rx113_0_N, Rx113_0_P, Rx113_1_N, Rx113_1_P, Rx113_2_N, Rx113_2_P, Rx113_3_N, Rx113_3_P, RxC8_N, RxC8_P, RxC9_N, RxC9_P, RxC10_N, RxC10_P, RxC11_N, RxC11_P, Tx0_N, Tx0_P, Tx1_N, Tx1_P, Tx4_N, Tx4_P, Tx5_N, Tx5_P, Tx6_N, Tx6_P, Tx7_N, Tx7_P, Tx8_N, Tx8_P, Tx9_N, Tx9_P, Tx10_N, Tx10_P, Tx11_N, Tx11_P, Tx113_0_N, Tx113_0_P, Tx113_1_N, Tx113_1_P, Tx113_2_N, Tx113_2_P, Tx113_3_N, Tx113_3_P, TxC8_N, TxC8_P, TxC9_N, TxC9_P, TxC10_N, TxC10_P, TxC11_N, TxC11_P
net class DE_SIG: FMC1_DP0_C2M_N, FMC1_DP0_C2M_P, FMC1_DP0_M2C_N, FMC1_DP0_M2C_P, FMC1_DP1_C2M_N, FMC1_DP1_C2M_P, FMC1_DP1_M2C_N, FMC1_DP1_M2C_P, FMC1_DP2_C2M_N, FMC1_DP2_C2M_P, FMC1_DP2_M2C_N, FMC1_DP2_M2C_P, FMC1_DP3_C2M_N, FMC1_DP3_C2M_P, FMC1_DP3_M2C_N, FMC1_DP3_M2C_P, FMC1_GBTCLK0_M2C_N, FMC1_GBTCLK0_M2C_P, FMC1_GBTCLK1_M2C_N, FMC1_GBTCLK1_M2C_P, FMC2_DP0_C2M_N, FMC2_DP0_C2M_P, FMC2_DP0_M2C_N, FMC2_DP0_M2C_P, FMC2_DP1_C2M_N, FMC2_DP1_C2M_P, FMC2_DP1_M2C_N, FMC2_DP1_M2C_P, FMC2_DP2_C2M_N, FMC2_DP2_C2M_P, FMC2_DP2_M2C_N, FMC2_DP2_M2C_P, FMC2_DP3_C2M_N, FMC2_DP3_C2M_P, FMC2_DP3_M2C_N, FMC2_DP3_M2C_P, FMC2_GBTCLK0_M2C_N, FMC2_GBTCLK0_M2C_P, FMC2_GBTCLK1_M2C_N, FMC2_GBTCLK1_M2C_P, FMCC1_DP0_C2M_N, FMCC1_DP0_C2M_P, FMCC1_DP0_M2C_N, FMCC1_DP0_M2C_P, FMCC1_DP1_C2M_N, FMCC1_DP1_C2M_P, FMCC1_DP1_M2C_N, FMCC1_DP1_M2C_P, FMCC1_DP2_C2M_N, FMCC1_DP2_C2M_P, FMCC1_DP2_M2C_N, FMCC1_DP2_M2C_P, FMCC1_DP3_C2M_N, FMCC1_DP3_C2M_P, FMCC1_DP3_M2C_N, FMCC1_DP3_M2C_P, FMCC1_GBTCLK0_M2C_N, FMCC1_GBTCLK0_M2C_P, FMCC1_GBTCLK1_M2C_N, FMCC1_GBTCLK1_M2C_P, FMCC2_DP0_C2M_N, FMCC2_DP0_C2M_P, FMCC2_DP0_M2C_N, FMCC2_DP0_M2C_P, FMCC2_DP1_C2M_N, FMCC2_DP1_C2M_P, FMCC2_DP1_M2C_N, FMCC2_DP1_M2C_P, FMCC2_DP2_C2M_N, FMCC2_DP2_C2M_P, FMCC2_DP2_M2C_N, FMCC2_DP2_M2C_P, FMCC2_DP3_C2M_N, FMCC2_DP3_C2M_P, FMCC2_DP3_M2C_N, FMCC2_DP3_M2C_P, FMCC2_GBTCLK0_M2C_N, FMCC2_GBTCLK0_M2C_P, FP2_CLK1_C_N, FP2_CLK1_C_P, FP2_CLK2_C_N, FP2_CLK2_C_P, LINKC01_CLK_N, LINKC01_CLK_P, MGT113_CLK0_N, MGT113_CLK0_P, MGT113_CLK1_N, MGT113_CLK1_P, PCIE_CLK1_C_N, PCIE_CLK1_C_P, PCIE_CLK1_N, PCIE_CLK1_P, PCIE_CLK2_C_N, PCIE_CLK2_C_P, PCIE_CLK2_N, PCIE_CLK2_P, Rx0_N, Rx0_P, Rx1_N, Rx1_P, Rx4_N, Rx4_P, Rx5_N, Rx5_P, Rx6_N, Rx6_P, Rx7_N, Rx7_P, Rx8_N, Rx8_P, Rx9_N, Rx9_P, Rx10_N, Rx10_P, Rx11_N, Rx11_P, Rx113_0_N, Rx113_0_P, Rx113_1_N, Rx113_1_P, Rx113_2_N, Rx113_2_P, Rx113_3_N, Rx113_3_P, RxC8_N, RxC8_P, RxC9_N, RxC9_P, RxC10_N, RxC10_P, RxC11_N, RxC11_P, Tx0_N, Tx0_P, Tx1_N, Tx1_P, Tx4_N, Tx4_P, Tx5_N, Tx5_P, Tx6_N, Tx6_P, Tx7_N, Tx7_P, Tx8_N, Tx8_P, Tx9_N, Tx9_P, Tx10_N, Tx10_P, Tx11_N, Tx11_P, Tx113_0_N, Tx113_0_P, Tx113_1_N, Tx113_1_P, Tx113_2_N, Tx113_2_P, Tx113_3_N, Tx113_3_P, TxC8_N, TxC8_P, TxC9_N, TxC9_P, TxC10_N, TxC10_P, TxC11_N, TxC11_P
net class DP1_C2M: FMC1_DP0_C2M_N, FMC1_DP0_C2M_P, FMC1_DP1_C2M_N, FMC1_DP1_C2M_P, FMC1_DP2_C2M_N, FMC1_DP2_C2M_P, FMC1_DP3_C2M_N, FMC1_DP3_C2M_P, FMCC1_DP0_C2M_N, FMCC1_DP0_C2M_P, FMCC1_DP1_C2M_N, FMCC1_DP1_C2M_P, FMCC1_DP2_C2M_N, FMCC1_DP2_C2M_P, FMCC1_DP3_C2M_N, FMCC1_DP3_C2M_P
net class DP1_M2C: FMC1_DP0_M2C_N, FMC1_DP0_M2C_P, FMC1_DP1_M2C_N, FMC1_DP1_M2C_P, FMC1_DP2_M2C_N, FMC1_DP2_M2C_P, FMC1_DP3_M2C_N, FMC1_DP3_M2C_P, FMC1_GBTCLK0_M2C_N, FMC1_GBTCLK0_M2C_P, FMC1_GBTCLK1_M2C_N, FMC1_GBTCLK1_M2C_P, FMCC1_DP0_M2C_N, FMCC1_DP0_M2C_P, FMCC1_DP1_M2C_N, FMCC1_DP1_M2C_P, FMCC1_DP2_M2C_N, FMCC1_DP2_M2C_P, FMCC1_DP3_M2C_N, FMCC1_DP3_M2C_P, FMCC1_GBTCLK0_M2C_N, FMCC1_GBTCLK0_M2C_P, FMCC1_GBTCLK1_M2C_N, FMCC1_GBTCLK1_M2C_P
net class DP2_C2M: FMC2_DP0_C2M_N, FMC2_DP0_C2M_P, FMC2_DP1_C2M_N, FMC2_DP1_C2M_P, FMC2_DP2_C2M_N, FMC2_DP2_C2M_P, FMC2_DP3_C2M_N, FMC2_DP3_C2M_P, FMCC2_DP0_C2M_N, FMCC2_DP0_C2M_P, FMCC2_DP1_C2M_N, FMCC2_DP1_C2M_P, FMCC2_DP2_C2M_N, FMCC2_DP2_C2M_P, FMCC2_DP3_C2M_N, FMCC2_DP3_C2M_P
net class DP2_M2C: FMC2_DP0_M2C_N, FMC2_DP0_M2C_P, FMC2_DP1_M2C_N, FMC2_DP1_M2C_P, FMC2_DP2_M2C_N, FMC2_DP2_M2C_P, FMC2_DP3_M2C_N, FMC2_DP3_M2C_P, FMC2_GBTCLK0_M2C_N, FMC2_GBTCLK0_M2C_P, FMC2_GBTCLK1_M2C_N, FMC2_GBTCLK1_M2C_P, FMCC2_DP0_M2C_N, FMCC2_DP0_M2C_P, FMCC2_DP1_M2C_N, FMCC2_DP1_M2C_P, FMCC2_DP2_M2C_N, FMCC2_DP2_M2C_P, FMCC2_DP3_M2C_N, FMCC2_DP3_M2C_P, FMCC2_GBTCLK0_M2C_N, FMCC2_GBTCLK0_M2C_P, LINKC01_CLK_N, LINKC01_CLK_P
net class SE50: MGTAVTT_R0, MGTAVTT_R1
net class SE_SIG: MGTAVTT_R0, MGTAVTT_R1

### Notes on the sheet
- Copyright LNLS 2012.
  This documentation describes Open Hardware and is licensed under the CERN OHL v.1.1. You may redistribute and modify this documentation under the terms of the CERN OHL v.1.1. (http://ohwr.org/CERNOHL). This documentation is distributed WITHOUT ANY EXPRESS OR IMPLIED WARRANTY, INCLUDING OF MERCHANTABILITY, SATISFACTORY QUALITY AND FITNESS FOR A PARTICULAR PURPOSE. Please see the CERN OHL v.1.1 for applicable conditions.
- PCIE
- Polarity Inverted
- GTP MAP
  GTP3 <-> PCIe3
  GTP2 <->PCIe2
  GTP1 <-> PCIe1
  GTP0 <-> PCIe0
  Mathcing TX, RX sepereately
- GTP MAP
  GTP3 <-> DP0
  GTP2 <-> DP1
  GTP1 <-> DP2
  GTP0 <-> DP3
  Mathcing only in P,N pair
- 4-9
  UNCONNECTED TO FPGA
- There is a error in schematic component block.
  LOOK at the order of GTP ports 0 1 3 2.
- Polarity Inverted to use as Port3
  Do not Invert to use as FP2
- Polarity Inverted to use as Port2
  Do not Invert to use as FP2
- Polarity Inverted to use as FP2
  Do not Invert to use as Port2
- Polarity Inverted to use as DP
  Do not Invert to use as Port1
- Polarity Inverted to use as FP2
  Do not Invert to use as Port0
- Polarity Inverted to use as DP
  Do not Invert to use as Port0
- Polarity Inverted to use as Port0
  Do not Invert to use as DP
- Polarity Inverted to use as FP2
  Do not Invert to use as Port1
- Polarity Inverted to use as Port1
  Do not Invert to use as FP2
- (near IC2) There is a fail in schematic component block.
  LOOK at the order of GTP ports 0 1 3 2.

### Library data of the parts
C178-C207 C219-C225 C227 C228 C318-C349 C402 C409 C411 C413 C455 C457 C459 C461 C463 C512 C514 C575 C590 C625-C635 C751-C753 = CAP_SMD_0201: Capacitor SMD
IC2 = XC7A350T-2FFG1156C: Artix-6 FPGA, 16 GTPs, 600 User I/Os, 1156-Pin BGA, Speed Grade 2, Commercial Grade, Pb-Free; Part Description: Artix-7 FPGA, 16 GTPs, 600 User I/Os, 1156-Pin BGA, Speed Grade 2, Commercial Grade, Pb-Free; Manufacturer: XILINX; Table: Logic; Part Number: XC7A350T-2FFG1156C; Component Kind: Standard; Component Type: Standard; Device: XC7A350T-2FFG1156C; PackageDescription: BGA, 1.00mm Pitch, Square; 1156 Pin, 34 Columns X 34 Rows, 35.00mm X 35.00mm X 3.350mm H; Manufacturer Part Number: XC7A350T-2FFG1156C; Pin Count: 1156; Case: BGA1156; Mounted: Yes; Socket: No; SMD: Yes; ComponentHeight: 3.35mm; HelpURL: \\cern.ch\dfs\Applications\Altium\Datasheets\XC7A350T-2FFG1156C.pdf; ComponentLink1URL: \\cern.ch\dfs\Applications\Altium\Datasheets\XC7A350T-2FFG1156C.pdf; ComponentLink1Description: Package/Pinout; Author: CERN DEM JLC; CreateDate: 2012-09-19; LatestRevisionDate: 2012-09-19
R142 R239 = RES_0402: SMD Resistor; Supplier 1: Newark; Supplier Part Number 1: 59M6691